# Altium schematic sheet ZynqMIO.SchDoc: =TITLE
size A3; DocumentNumber: 4; SheetNumber: 4; SheetTotal: 11
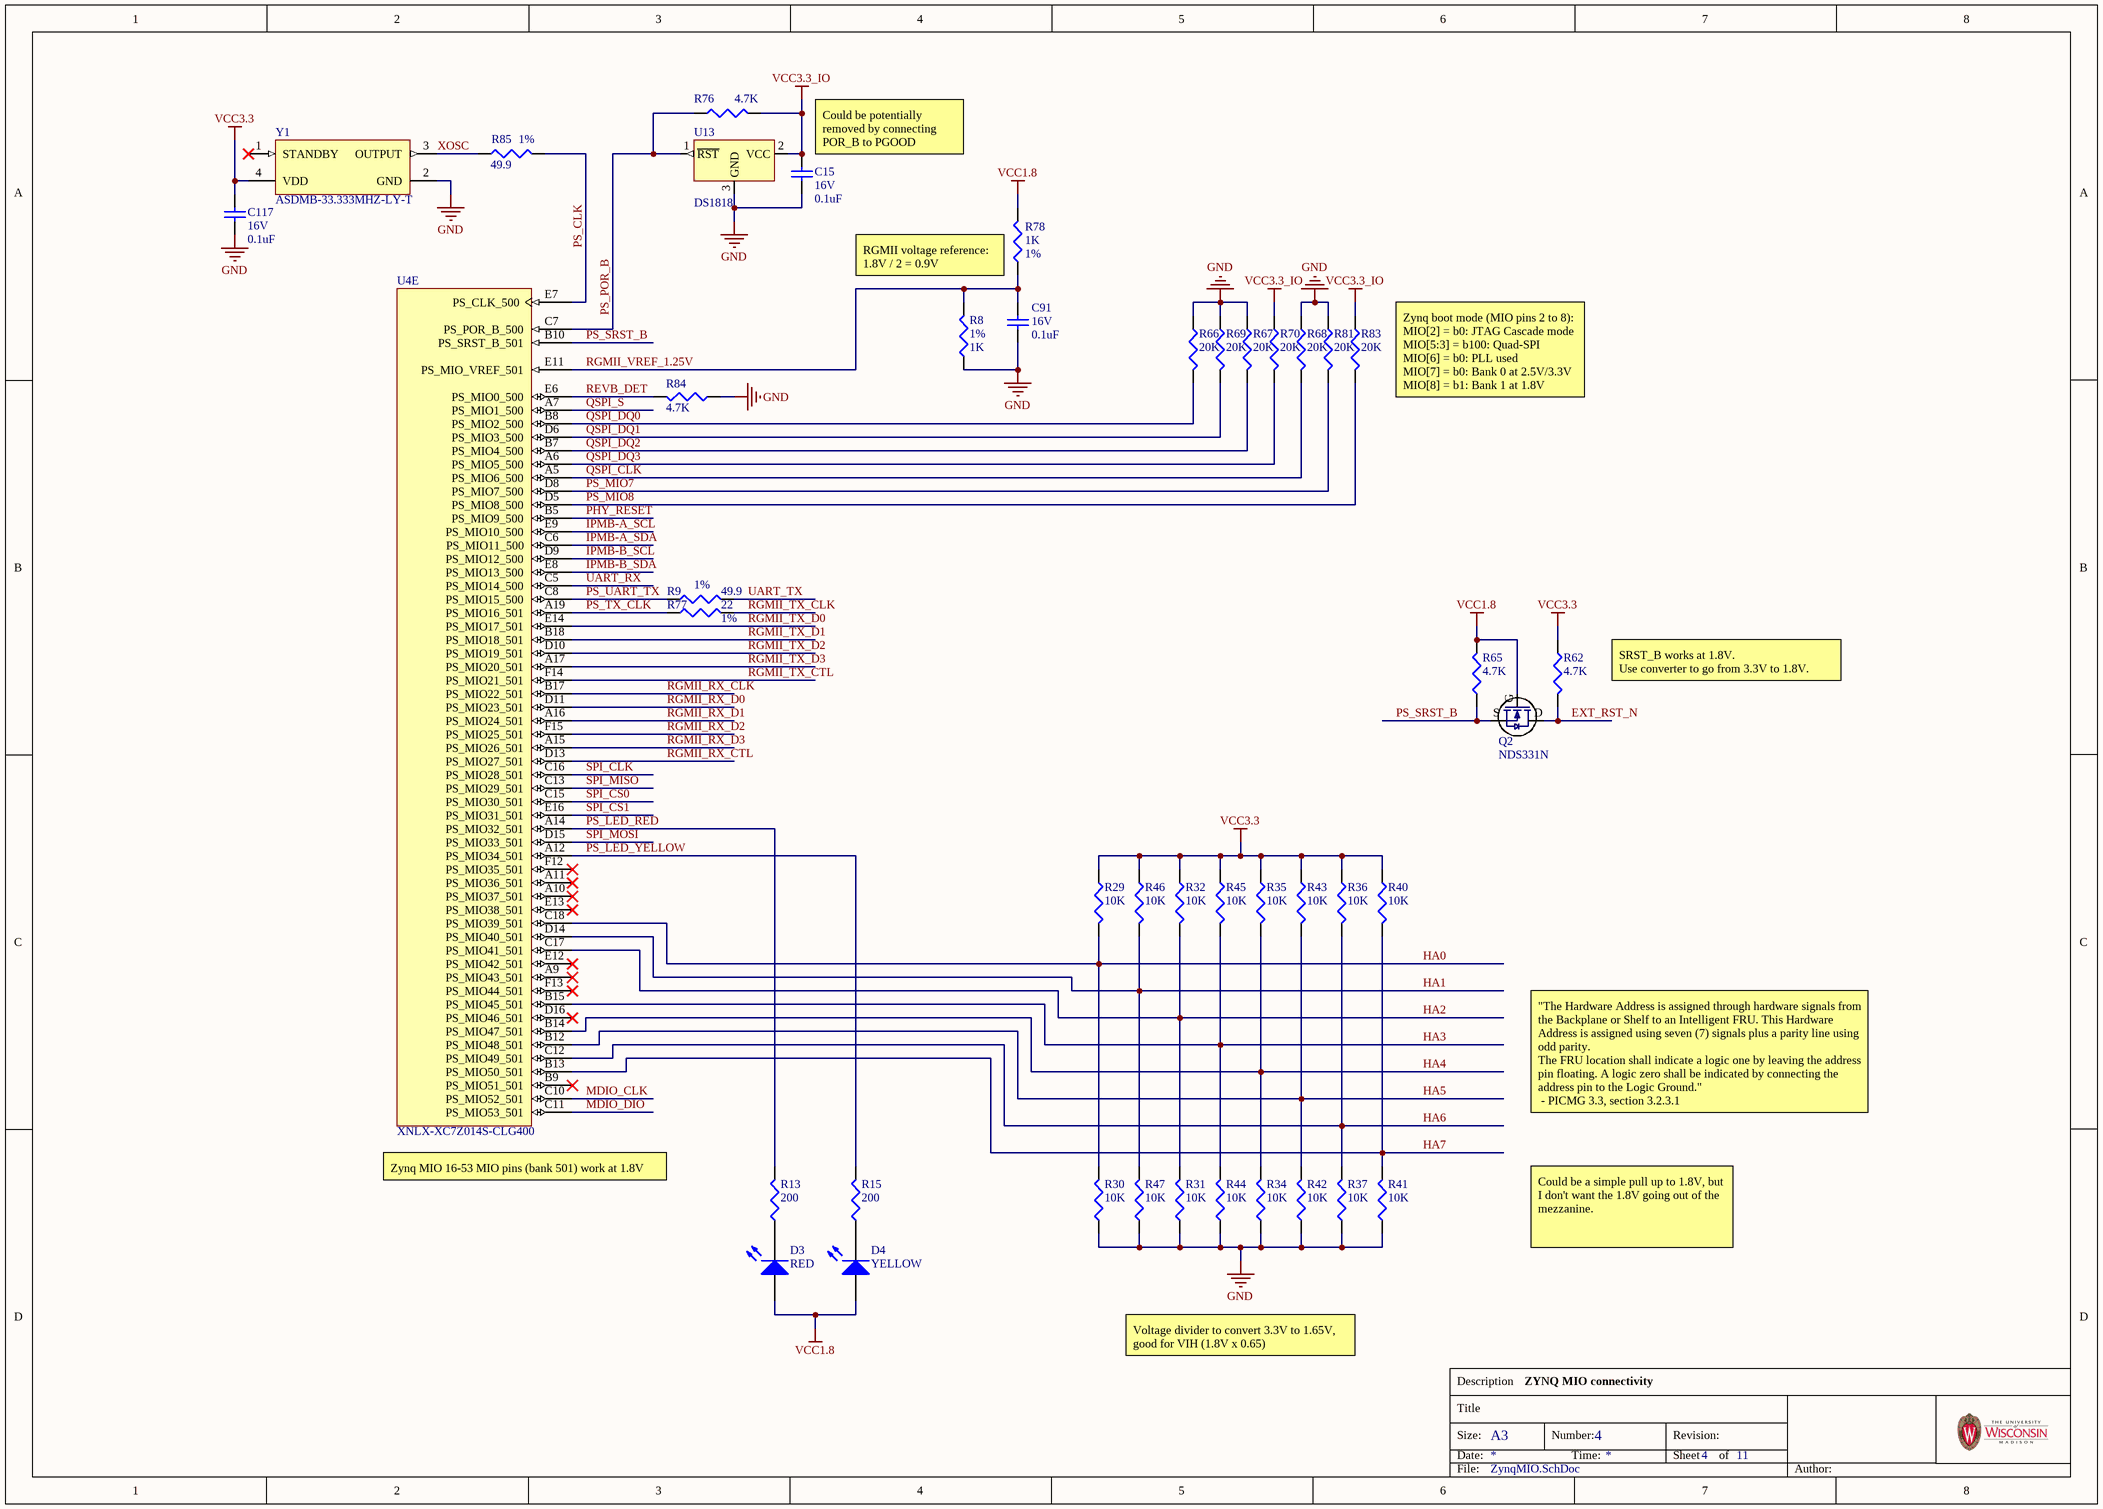
[diagram p0: ZynqMIO.SchDoc]

## Parts
C15  value 0.1uF  Rating: 16V  [C0402_IPC_H]  (hidden comment: ?)
C91  value 0.1uF  Rating: 16V  [C0402_IPC_H]  (hidden comment: ?)
C117  value 0.1uF  Rating: 16V  [C0402_IPC_H]  (hidden comment: ?)
D3  value RED  [LED0603_M]  (hidden comment: ?)
D4  value YELLOW  [LED0603_M]  (hidden comment: ?)
Q2  NDS331N  [SOT23-H]
R8  value 1K  Tolerance: 1%  [R0402_IPC_H]  (hidden comment: ?)
R9  value 49.9  Tolerance: 1%  [R0402_IPC_H]  (hidden comment: ?)
R13  value 200  [R0402_IPC_H]  (hidden comment: ?)
R15  value 200  [R0402_IPC_H]  (hidden comment: ?)
R29  value 10K  [R0201_IPC_H]  (hidden comment: ?)
R30  value 10K  [R0201_IPC_H]  (hidden comment: ?)
R31  value 10K  [R0201_IPC_H]  (hidden comment: ?)
R32  value 10K  [R0201_IPC_H]  (hidden comment: ?)
R34  value 10K  [R0201_IPC_H]  (hidden comment: ?)
R35  value 10K  [R0201_IPC_H]  (hidden comment: ?)
R36  value 10K  [R0201_IPC_H]  (hidden comment: ?)
R37  value 10K  [R0201_IPC_H]  (hidden comment: ?)
R40  value 10K  [R0201_IPC_H]  (hidden comment: ?)
R41  value 10K  [R0201_IPC_H]  (hidden comment: ?)
R42  value 10K  [R0201_IPC_H]  (hidden comment: ?)
R43  value 10K  [R0201_IPC_H]  (hidden comment: ?)
R44  value 10K  [R0201_IPC_H]  (hidden comment: ?)
R45  value 10K  [R0201_IPC_H]  (hidden comment: ?)
R46  value 10K  [R0201_IPC_H]  (hidden comment: ?)
R47  value 10K  [R0201_IPC_H]  (hidden comment: ?)
R62  value 4.7K  [R0402_IPC_H]  (hidden comment: ?)
R65  value 4.7K  [R0402_IPC_H]  (hidden comment: ?)
R66  value 20K  [R0402_IPC_H]  (hidden comment: ?)
R67  value 20K  [R0402_IPC_H]  (hidden comment: ?)
R68  value 20K  [R0402_IPC_H]  (hidden comment: ?)
R69  value 20K  [R0402_IPC_H]  (hidden comment: ?)
R70  value 20K  [R0402_IPC_H]  (hidden comment: ?)
R76  value 4.7K  [R0402_IPC_H]  (hidden comment: ?)
R77  value 22  Tolerance: 1%  [R0201_IPC_H]  (hidden comment: ?)
R78  value 1K  Tolerance: 1%  [R0402_IPC_H]  (hidden comment: ?)
R81  value 20K  [R0402_IPC_H]  (hidden comment: ?)
R83  value 20K  [R0402_IPC_H]  (hidden comment: ?)
R84  value 4.7K  [R0402_IPC_H]  (hidden comment: ?)
R85  value 49.9  Tolerance: 1%  [R0402_IPC_H]  (hidden comment: ?)
U4  XNLX-XC7Z014S-CLG400  [CLG400]  (part E of 9)
U13  DS1818  [SOT23-H]
Y1  ASDMB-33.333MHZ-LY-T  [ABRA-ASDMB-4_V]

## Nets
GND: C15.1 C91.1 C117.1 R8.2 R30.1 R31.1 R34.1 R37.1 R41.1 R42.1 R44.1 R47.1 R66.1 R67.1 R68.1 R69.1 R81.1 R84.1 U13.3(GND) Y1.2(GND)
VCC1.8: D3.1(A) D4.1(A) Q2.G R65.2 R78.1
VCC3.3: C117.2 R29.1 R32.1 R35.1 R36.1 R40.1 R43.1 R45.1 R46.1 R62.1 Y1.4(VDD)
VCC3.3_IO: C15.2 R70.1 R76.1 R83.1 U13.2(VCC)
~{QSPI_S}: U4.A7(PS_MIO1_500)
~{SPI_CS0}: U4.C15(PS_MIO30_501)
~{SPI_CS1}: U4.E16(PS_MIO31_501)
EXT_RST_N: Q2.D R62.2
HA0: R29.2 R30.2 U4.C18(PS_MIO39_501)
HA1: R46.2 R47.2 U4.D14(PS_MIO40_501)
HA2: R31.2 R32.2 U4.C17(PS_MIO41_501)
HA3: R44.2 R45.2 U4.B15(PS_MIO45_501)
HA4: R34.2 R35.2 U4.B14(PS_MIO47_501)
HA5: R42.2 R43.2 U4.B12(PS_MIO48_501)
HA6: R36.2 R37.2 U4.C12(PS_MIO49_501)
HA7: R40.2 R41.2 U4.B13(PS_MIO50_501)
IPMB-A_SCL: U4.E9(PS_MIO10_500)
IPMB-A_SDA: U4.C6(PS_MIO11_500)
IPMB-B_SCL: U4.D9(PS_MIO12_500)
IPMB-B_SDA: U4.E8(PS_MIO13_500)
MDIO_CLK: U4.C10(PS_MIO52_501)
MDIO_DIO: U4.C11(PS_MIO53_501)
PHY_RESET: U4.B5(PS_MIO9_500)
PS_CLK: R85.1 U4.E7(PS_CLK_500)
PS_LED_RED: R13.2 U4.A14(PS_MIO32_501)
PS_LED_YELLOW: R15.2 U4.A12(PS_MIO34_501)
PS_MIO7: R81.2 U4.D8(PS_MIO7_500)
PS_MIO8: R83.2 U4.D5(PS_MIO8_500)
PS_POR_B: R76.2 U4.C7(PS_POR_B_500) U13.1(~{RST})
PS_SRST_B: Q2.S R65.1 U4.B10(PS_SRST_B_501)
PS_TX_CLK: R77.1 U4.A19(PS_MIO16_501)
PS_UART_TX: R9.2 U4.C8(PS_MIO15_500)
QSPI_CLK: R68.2 U4.A5(PS_MIO6_500)
QSPI_DQ0: R66.2 U4.B8(PS_MIO2_500)
QSPI_DQ1: R69.2 U4.D6(PS_MIO3_500)
QSPI_DQ2: R67.2 U4.B7(PS_MIO4_500)
QSPI_DQ3: R70.2 U4.A6(PS_MIO5_500)
REVB_DET: R84.2 U4.E6(PS_MIO0_500)
RGMII_RX_CLK: U4.B17(PS_MIO22_501)
RGMII_RX_CTL: U4.D13(PS_MIO27_501)
RGMII_RX_D0: U4.D11(PS_MIO23_501)
RGMII_RX_D1: U4.A16(PS_MIO24_501)
RGMII_RX_D2: U4.F15(PS_MIO25_501)
RGMII_RX_D3: U4.A15(PS_MIO26_501)
RGMII_TX_CLK: R77.2
RGMII_TX_CTL: U4.F14(PS_MIO21_501)
RGMII_TX_D0: U4.E14(PS_MIO17_501)
RGMII_TX_D1: U4.B18(PS_MIO18_501)
RGMII_TX_D2: U4.D10(PS_MIO19_501)
RGMII_TX_D3: U4.A17(PS_MIO20_501)
RGMII_VREF_1.25V: C91.2 R8.1 R78.2 U4.E11(PS_MIO_VREF_501)
SPI_CLK: U4.C16(PS_MIO28_501)
SPI_MISO: U4.C13(PS_MIO29_501)
SPI_MOSI: U4.D15(PS_MIO33_501)
UART_RX: U4.C5(PS_MIO14_500)
UART_TX: R9.1
XOSC: R85.2 Y1.3(OUTPUT)
NetD3_2: D3.2(K) R13.1
NetD4_2: D4.2(K) R15.1

Not connected (* = marked no-connect by the designer): U4 A9(PS_MIO43_501)* A10(PS_MIO37_501)* A11(PS_MIO36_501)* B9(PS_MIO51_501)* D16(PS_MIO46_501)* E12(PS_MIO42_501)* E13(PS_MIO38_501)* F12(PS_MIO35_501)* F13(PS_MIO44_501)*; Y1 1(STANDBY)*

## Notes on the sheet
- (near C15) Could be potentially removed by connecting POR_B to PGOOD
- (near R78) RGMII voltage reference:
  1.8V / 2 = 0.9V
- (near R83) Zynq boot mode (MIO pins 2 to 8):
  MIO[2] = b0: JTAG Cascade mode
  MIO[5:3] = b100: Quad-SPI
  MIO[6] = b0: PLL used
  MIO[7] = b0: Bank 0 at 2.5V/3.3V
  MIO[8] = b1: Bank 1 at 1.8V
- SRST_B works at 1.8V.
  Use converter to go from 3.3V to 1.8V.
- "The Hardware Address is assigned through hardware signals from the Backplane or Shelf to an Intelligent FRU. This Hardware Address is assigned using seven (7) signals plus a parity line using odd parity.
  The FRU location shall indicate a logic one by leaving the address pin floating. A logic zero shall be indicated by connecting the address pin to the Logic Ground."
  - PICMG 3.3, section 3.2.3.1
- (near U4) Zynq MIO 16-53 MIO pins (bank 501) work at 1.8V
- Could be a simple pull up to 1.8V, but I don't want the 1.8V going out of the mezzanine.
- Voltage divider to convert 3.3V to 1.65V, good for VIH (1.8V x 0.65)
- ZYNQ MIO connectivity
- Description
- Title
- Size:
- Date:
- A3
- Number:
- Time:
- Revision:
- Sheet
- of
- File:
- Author:

## Library data of the parts
C15 C91 C117 = Cap: Capacitor; Manufacturer: Murata; Part: GRM155R71C104KA88D; INVKEY: CP0402-0.1UF-16V-10%; PackageDescription: Chip Capacitor
D3 = LED: Light Emitting Diode; Manufacturer: Lite-On; Part: LTST-C190KRKT; INVKEY: LED-RD-TOP-0603
D4 = LED: Light Emitting Diode; Manufacturer: Lite-On; Part: LTST-C190KSKT; INVKEY: LED-YLW-TOP-0603
Q2 = NDS331N: N-Channel   Logic Level Enhancement Mode Field Effect Transistor; pin to pad: D>3 G>1 S>2; Manufacturer: Fairchild; INVKEY: FET-NDS331N-SSOT23; Part: NDS331N
R8 R78 = Res: Resistor; Manufacturer: Panasonic-ECG; Part: ERJ-2RKF1001X; INVKEY: RS0402-1K-1/10W-1%; PackageDescription: Chip Resistor
R9 R85 = Res: Resistor; Manufacturer: Panasonic; Part: ERJ-2RKF49R9X; INVKEY: RS0402-49R9-1/10W-1%; PackageDescription: Chip Resistor
R13 R15 = Res: Resistor; Manufacturer: Panasonic-ECG; Part: ERJ-2RKF2000X; Tolerance: 1%; INVKEY: RS0402-200R-1/10W-1%; PackageDescription: Chip Resistor
R29-R32 R34-R37 R40-R47 = Res: Resistor; Manufacturer: Panasonic; Part: ERJ-1GNF1002C; Tolerance: 1%; INVKEY: RS0201-10K-1/20W-1%; PackageDescription: Chip Resistor
R62 R65 R76 R84 = Res: Resistor; Manufacturer: Panasonic; Part: ERJ-2RKF4701X; Tolerance: 1%; INVKEY: RS0402-4K7-1/10W-1%; PackageDescription: Chip Resistor
R66-R70 R81 R83 = Res: Resistor; Manufacturer: Panasonic-ECG; Part: ERJ-2RKF2002X; Tolerance: 1%; INVKEY: RS0402-20K-1/10W-1%; PackageDescription: Chip Resistor
R77 = Res: Resistor; Manufacturer: Panasonic; Part: ERJ-1GNF22R0C; INVKEY: RS0201-22R-1/20W-1%; PackageDescription: Chip Resistor
U4 = XNLX-XC7Z020-CLG400: Manufacturer: Xilinx; Part: XC7Z014S-1CLG400C; INVKEY: ?
U13 = DS1818: 3.3V EconoReset with Pushbutton; Manufacturer: Maxim; Part: DS1818R-10; INVKEY: IC-RST-1818R-10
Y1 = CMP-0728-00001-1: Plastic Package Clock Oscillator, 3.6864 MHz Frequency, 15 pF Output Load, 4-Pin 2.5 x 2 x 0.9 mm SMD, -40 to 85 degC, RoHS, Reel; PartNumber: ASDMB-3.6864MHZ-LC-T; Manufacturer: Abracon; Disable Stand-by Current: 15 uA Max.; Output Load: 15 pF; Startup Time: 1.5 ms Typ.; Overall Freq.Stability: +/- 50 ppm (STD); Supply Voltage: 1.8 to 3.3 V; Disable Time: 20 ns Typ.; INVKEY: CRY-ASDMB-33.333MHZ; ComponentLink1Description: Manufacturer URL; RoHS: TRUE; PackageVersion: Oct-13; PackageDescription: 4-Pin SMD, Body 2.5 x 2 mm, Height 0.9 mm; DatasheetVersion: Oct-13; ComponentLink3URL: http://www.abracon.com/Oscillators/ASDMB.pdf; ComponentLink2Description: Datasheet; Mounting Technology: Surface Mount; ComponentLink2URL: http://www.abracon.com/Oscillators/ASDMB.pdf; ComponentLink3Description: Package Specification; PackageReference: ASDMB-4; ComponentLink1URL: http://www.abracon.com/; Operating Temperature Range: -40 to 85 degC; Packing: Reel; Frequency: 33.333 MHz; Part: ASDMB-33.333MHZ-LY